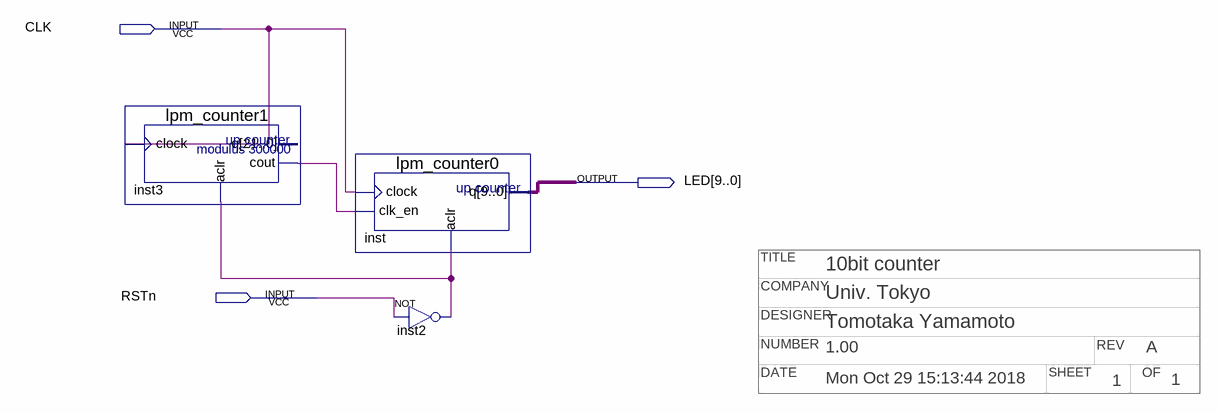
[diagram p0: schematic sheet]
// Quartus schematic a03_10bitcounter.bdf as structural Verilog: 3 symbols, 3 pins
// Title block: COMPANY: Univ. Tokyo; DATE: Mon Oct 29 15:13:44 2018; DESIGNER: Tomotaka Yamamoto; NUMBER: 1.00; OF: 1; REV: A; SHEET: 1; TITLE: 10bit counter
module a03_10bitcounter (
  input  CLK,
  input  RSTn,
  output [9:0] LED
);

  wire inst2_out, inst3_cout;

  lpm_counter1 inst3 (.clock(CLK), .aclr(inst2_out), .cout(inst3_cout));  // open: q
  lpm_counter0 inst (.clock(CLK), .clk_en(inst3_cout), .aclr(inst2_out), .q(LED));
  not inst2 (inst2_out, RSTn);
endmodule
